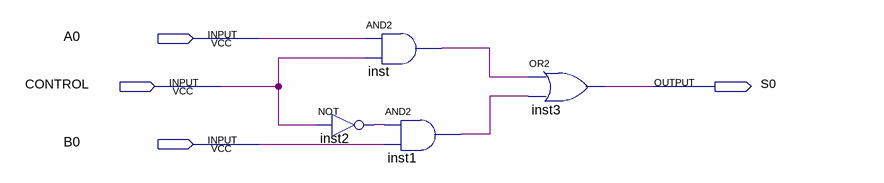
[diagram p0: schematic sheet]
// Quartus schematic MULTIPLEX.bdf as structural Verilog: 4 symbols, 4 pins
module MULTIPLEX (
  input  A0,
  input  CONTROL,
  input  B0,
  output S0
);

  wire inst1_out, inst2_out, inst_out;

  and inst (inst_out, A0, CONTROL);
  and inst1 (inst1_out, inst2_out, B0);
  not inst2 (inst2_out, CONTROL);
  or inst3 (S0, inst_out, inst1_out);
endmodule
